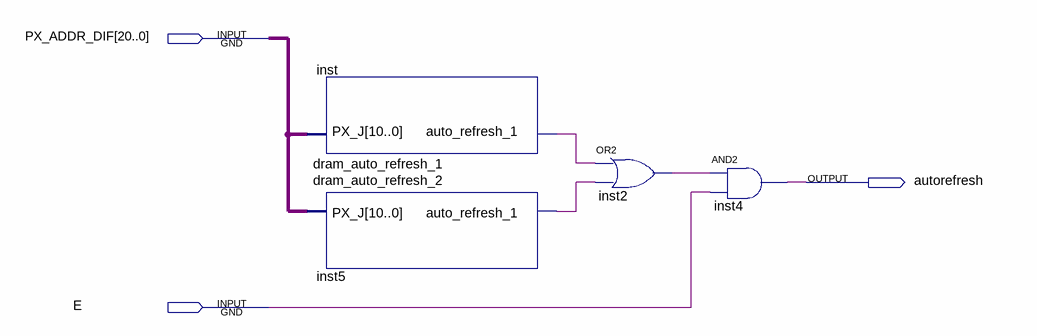
[diagram p0: schematic sheet]
// Quartus schematic artc.bdf as structural Verilog: 4 symbols, 3 pins
module artc (
  input  [20:0] PX_ADDR_DIF,
  input  E,
  output autorefresh
);

  wire inst2_out, inst5_auto_refresh_1, inst_auto_refresh_1;

  dram_auto_refresh_1 inst (.PX_J(PX_ADDR_DIF[10:0]), .auto_refresh_1(inst_auto_refresh_1));
  dram_auto_refresh_2 inst5 (.PX_J(PX_ADDR_DIF[10:0]), .auto_refresh_1(inst5_auto_refresh_1));
  or inst2 (inst2_out, inst_auto_refresh_1, inst5_auto_refresh_1);
  and inst4 (autorefresh, inst2_out, E);

  // Other names for the same wires on the sheet: PX_I[9:0] = PX_ADDR_DIF[20:11]; PX_J[10:0] = PX_ADDR_DIF[10:0]
endmodule
